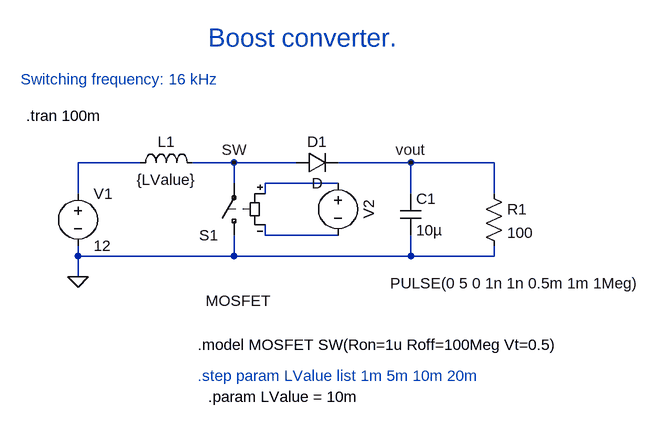
[diagram p0: schematic Draft1.asc]
Draft1.asc, the LTspice schematic file:
Version 4.1
SHEET 1 880 680
WIRE -144 96 -240 96
WIRE 0 96 -64 96
WIRE 96 96 0 96
WIRE 272 96 160 96
WIRE 400 96 272 96
WIRE 0 128 0 96
WIRE 160 128 48 128
WIRE -240 144 -240 96
WIRE 48 144 48 128
WIRE 272 144 272 96
WIRE 400 144 400 96
WIRE 48 208 48 192
WIRE 160 208 48 208
WIRE -240 240 -240 224
WIRE 0 240 0 208
WIRE 0 240 -240 240
WIRE 272 240 272 208
WIRE 272 240 0 240
WIRE 400 240 400 224
WIRE 400 240 272 240
WIRE -240 272 -240 240
FLAG -240 272 0
FLAG 0 96 SW
FLAG 272 96 vout
SYMBOL voltage -240 128 R0
WINDOW 123 0 0 Left 0
WINDOW 39 0 0 Left 0
SYMATTR InstName V1
SYMATTR Value 12
SYMBOL ind -160 112 R270
WINDOW 0 32 56 VTop 2
WINDOW 3 5 56 VBottom 2
SYMATTR InstName L1
SYMATTR Value {LValue}
SYMBOL sw 0 224 R180
WINDOW 3 -57 -85 Left 2
SYMATTR Value MOSFET
SYMATTR InstName S1
SYMBOL voltage 160 112 R0
WINDOW 0 32 56 VTop 2
WINDOW 3 273 185 Bottom 2
WINDOW 123 0 0 Left 0
WINDOW 39 0 0 Left 0
SYMATTR InstName V2
SYMATTR Value PULSE(0 5 0 1n 1n 0.5m 1m 1Meg)
SYMBOL diode 96 112 R270
WINDOW 0 32 32 VTop 2
WINDOW 3 0 32 VBottom 2
SYMATTR InstName D1
SYMBOL cap 256 144 R0
SYMATTR InstName C1
SYMATTR Value 10µ
SYMBOL res 384 128 R0
SYMATTR InstName R1
SYMATTR Value 100
TEXT -320 24 Left 2 !.tran 100m
TEXT -56 376 Left 2 !.model MOSFET SW(Ron=1u Roff=100Meg Vt=0.5)
TEXT -328 -32 Left 2 ;Switching frequency: 16 kHz
TEXT -40 -96 Left 4 ;Boost converter.
TEXT -56 424 Left 2 ;.step param LValue list 1m 5m 10m 20m
TEXT -40 456 Left 2 !.param LValue = 10m

The netlist it stands for:
* Draft1.asc
V1 N001 0 12
L1 N001 SW {LValue}
S1 0 SW N002 N003 MOSFET
V2 N002 N003 PULSE(0 5 0 1n 1n 0.5m 1m 1Meg)
D1 SW vout D
C1 vout 0 10µ
R1 vout 0 100
.model D D
.lib standard.dio
.tran 100m
.model MOSFET SW(Ron=1u Roff=100Meg Vt=0.5)
* Switching frequency: 16 kHz
* Boost converter.
* .step param LValue list 1m 5m 10m 20m
.param LValue = 10m
.backanno
.end